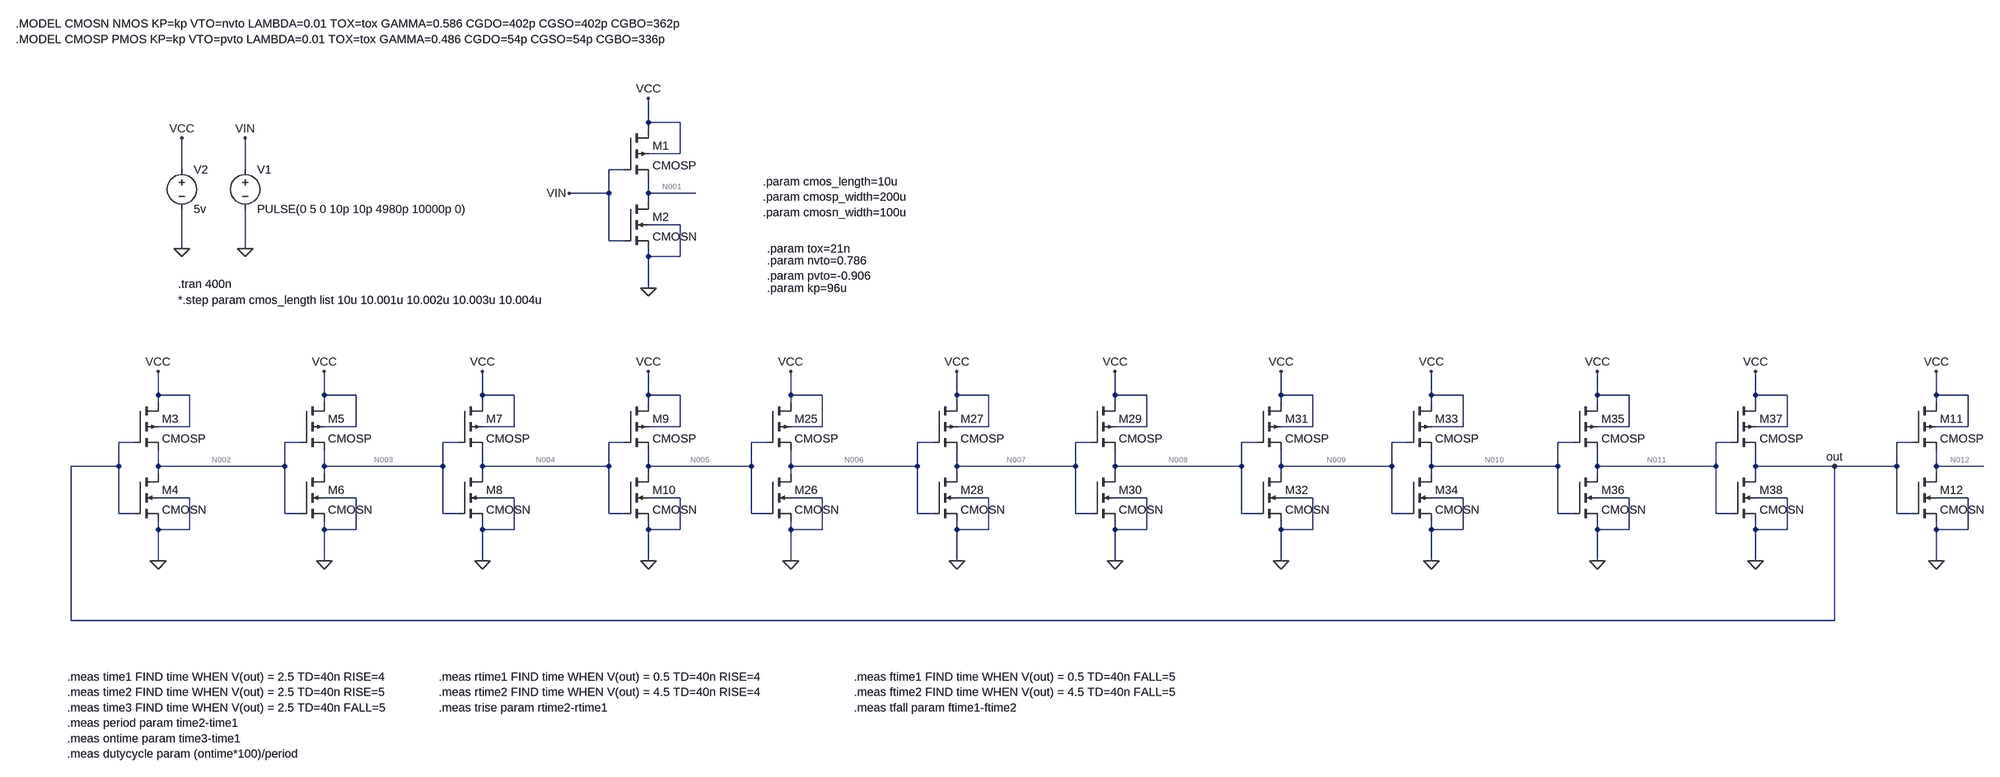
[diagram p0: schematic Ring Oscillator.asc]
Ring Oscillator.asc, the LTspice schematic file:
Version 4
SHEET 1 3220 2068
WIRE 416 112 416 64
WIRE 480 112 416 112
WIRE 416 128 416 112
WIRE 480 176 480 112
WIRE 480 176 416 176
WIRE -528 208 -528 144
WIRE -400 208 -400 144
WIRE 368 208 336 208
WIRE 336 256 336 208
WIRE 336 256 256 256
WIRE 416 256 416 224
WIRE 512 256 416 256
WIRE 416 272 416 256
WIRE 480 320 416 320
WIRE 336 352 336 256
WIRE 368 352 336 352
WIRE -528 368 -528 288
WIRE -400 368 -400 288
WIRE 416 384 416 368
WIRE 480 384 480 320
WIRE 480 384 416 384
WIRE 416 448 416 384
WIRE -576 720 -576 672
WIRE -512 720 -576 720
WIRE -240 720 -240 672
WIRE -176 720 -240 720
WIRE 80 720 80 672
WIRE 144 720 80 720
WIRE 416 720 416 672
WIRE 480 720 416 720
WIRE 704 720 704 672
WIRE 768 720 704 720
WIRE 1040 720 1040 672
WIRE 1104 720 1040 720
WIRE 1360 720 1360 672
WIRE 1424 720 1360 720
WIRE 1696 720 1696 672
WIRE 1760 720 1696 720
WIRE 2000 720 2000 672
WIRE 2064 720 2000 720
WIRE 2336 720 2336 672
WIRE 2400 720 2336 720
WIRE 2656 720 2656 672
WIRE 2720 720 2656 720
WIRE 3120 720 3120 672
WIRE 3184 720 3120 720
WIRE -576 736 -576 720
WIRE -240 736 -240 720
WIRE 80 736 80 720
WIRE 416 736 416 720
WIRE 704 736 704 720
WIRE 1040 736 1040 720
WIRE 1360 736 1360 720
WIRE 1696 736 1696 720
WIRE 2000 736 2000 720
WIRE 2336 736 2336 720
WIRE 2656 736 2656 720
WIRE 3120 736 3120 720
WIRE -512 784 -512 720
WIRE -512 784 -576 784
WIRE -176 784 -176 720
WIRE -176 784 -240 784
WIRE 144 784 144 720
WIRE 144 784 80 784
WIRE 480 784 480 720
WIRE 480 784 416 784
WIRE 768 784 768 720
WIRE 768 784 704 784
WIRE 1104 784 1104 720
WIRE 1104 784 1040 784
WIRE 1424 784 1424 720
WIRE 1424 784 1360 784
WIRE 1760 784 1760 720
WIRE 1760 784 1696 784
WIRE 2064 784 2064 720
WIRE 2064 784 2000 784
WIRE 2400 784 2400 720
WIRE 2400 784 2336 784
WIRE 2720 784 2720 720
WIRE 2720 784 2656 784
WIRE 3184 784 3184 720
WIRE 3184 784 3120 784
WIRE -624 816 -656 816
WIRE -288 816 -320 816
WIRE 32 816 0 816
WIRE 368 816 336 816
WIRE 656 816 624 816
WIRE 992 816 960 816
WIRE 1312 816 1280 816
WIRE 1648 816 1616 816
WIRE 1952 816 1920 816
WIRE 2288 816 2256 816
WIRE 2608 816 2576 816
WIRE 3072 816 3040 816
WIRE -656 864 -656 816
WIRE -656 864 -752 864
WIRE -576 864 -576 832
WIRE -320 864 -320 816
WIRE -320 864 -576 864
WIRE -240 864 -240 832
WIRE 0 864 0 816
WIRE 0 864 -240 864
WIRE 80 864 80 832
WIRE 336 864 336 816
WIRE 336 864 80 864
WIRE 416 864 416 832
WIRE 624 864 624 816
WIRE 624 864 416 864
WIRE 704 864 704 832
WIRE 960 864 960 816
WIRE 960 864 704 864
WIRE 1040 864 1040 832
WIRE 1280 864 1280 816
WIRE 1280 864 1040 864
WIRE 1360 864 1360 832
WIRE 1616 864 1616 816
WIRE 1616 864 1360 864
WIRE 1696 864 1696 832
WIRE 1920 864 1920 816
WIRE 1920 864 1696 864
WIRE 2000 864 2000 832
WIRE 2256 864 2256 816
WIRE 2256 864 2000 864
WIRE 2336 864 2336 832
WIRE 2576 864 2576 816
WIRE 2576 864 2336 864
WIRE 2656 864 2656 832
WIRE 2816 864 2656 864
WIRE 3040 864 3040 816
WIRE 3040 864 2816 864
WIRE 3120 864 3120 832
WIRE 3216 864 3120 864
WIRE -576 880 -576 864
WIRE -240 880 -240 864
WIRE 80 880 80 864
WIRE 416 880 416 864
WIRE 704 880 704 864
WIRE 1040 880 1040 864
WIRE 1360 880 1360 864
WIRE 1696 880 1696 864
WIRE 2000 880 2000 864
WIRE 2336 880 2336 864
WIRE 2656 880 2656 864
WIRE 3120 880 3120 864
WIRE -512 928 -576 928
WIRE -176 928 -240 928
WIRE 144 928 80 928
WIRE 480 928 416 928
WIRE 768 928 704 928
WIRE 1104 928 1040 928
WIRE 1424 928 1360 928
WIRE 1760 928 1696 928
WIRE 2064 928 2000 928
WIRE 2400 928 2336 928
WIRE 2720 928 2656 928
WIRE 3184 928 3120 928
WIRE -656 960 -656 864
WIRE -624 960 -656 960
WIRE -320 960 -320 864
WIRE -288 960 -320 960
WIRE 0 960 0 864
WIRE 32 960 0 960
WIRE 336 960 336 864
WIRE 368 960 336 960
WIRE 624 960 624 864
WIRE 656 960 624 960
WIRE 960 960 960 864
WIRE 992 960 960 960
WIRE 1280 960 1280 864
WIRE 1312 960 1280 960
WIRE 1616 960 1616 864
WIRE 1648 960 1616 960
WIRE 1920 960 1920 864
WIRE 1952 960 1920 960
WIRE 2256 960 2256 864
WIRE 2288 960 2256 960
WIRE 2576 960 2576 864
WIRE 2608 960 2576 960
WIRE 3040 960 3040 864
WIRE 3072 960 3040 960
WIRE -576 992 -576 976
WIRE -512 992 -512 928
WIRE -512 992 -576 992
WIRE -240 992 -240 976
WIRE -176 992 -176 928
WIRE -176 992 -240 992
WIRE 80 992 80 976
WIRE 144 992 144 928
WIRE 144 992 80 992
WIRE 416 992 416 976
WIRE 480 992 480 928
WIRE 480 992 416 992
WIRE 704 992 704 976
WIRE 768 992 768 928
WIRE 768 992 704 992
WIRE 1040 992 1040 976
WIRE 1104 992 1104 928
WIRE 1104 992 1040 992
WIRE 1360 992 1360 976
WIRE 1424 992 1424 928
WIRE 1424 992 1360 992
WIRE 1696 992 1696 976
WIRE 1760 992 1760 928
WIRE 1760 992 1696 992
WIRE 2000 992 2000 976
WIRE 2064 992 2064 928
WIRE 2064 992 2000 992
WIRE 2336 992 2336 976
WIRE 2400 992 2400 928
WIRE 2400 992 2336 992
WIRE 2656 992 2656 976
WIRE 2720 992 2720 928
WIRE 2720 992 2656 992
WIRE 3120 992 3120 976
WIRE 3184 992 3184 928
WIRE 3184 992 3120 992
WIRE -576 1056 -576 992
WIRE -240 1056 -240 992
WIRE 80 1056 80 992
WIRE 416 1056 416 992
WIRE 704 1056 704 992
WIRE 1040 1056 1040 992
WIRE 1360 1056 1360 992
WIRE 1696 1056 1696 992
WIRE 2000 1056 2000 992
WIRE 2336 1056 2336 992
WIRE 2656 1056 2656 992
WIRE 3120 1056 3120 992
WIRE -752 1200 -752 864
WIRE 2816 1200 2816 864
WIRE 2816 1200 -752 1200
FLAG -400 368 0
FLAG -400 144 VIN
FLAG 416 448 0
FLAG 416 64 VCC
FLAG -528 368 0
FLAG -528 144 VCC
FLAG 256 256 VIN
FLAG -576 1056 0
FLAG -576 672 VCC
FLAG -240 1056 0
FLAG -240 672 VCC
FLAG 80 1056 0
FLAG 80 672 VCC
FLAG 416 1056 0
FLAG 416 672 VCC
FLAG 704 1056 0
FLAG 704 672 VCC
FLAG 1040 1056 0
FLAG 1040 672 VCC
FLAG 1360 1056 0
FLAG 1360 672 VCC
FLAG 1696 1056 0
FLAG 1696 672 VCC
FLAG 2000 1056 0
FLAG 2000 672 VCC
FLAG 2336 1056 0
FLAG 2336 672 VCC
FLAG 2656 1056 0
FLAG 2656 672 VCC
FLAG 3120 1056 0
FLAG 3120 672 VCC
FLAG 2816 864 out
SYMBOL pmos4 368 128 R0
SYMATTR InstName M1
SYMATTR Value CMOSP
SYMATTR Value2 l=cmos_length w=cmosp_width
SYMBOL nmos4 368 272 R0
SYMATTR InstName M2
SYMATTR Value CMOSN
SYMATTR Value2 l=cmos_length w=cmosn_width
SYMBOL voltage -400 192 R0
WINDOW 123 0 0 Left 0
WINDOW 39 0 0 Left 0
SYMATTR InstName V1
SYMATTR Value PULSE(0 5 0 10p 10p 4980p 10000p 0)
SYMBOL voltage -528 192 R0
WINDOW 123 0 0 Left 0
WINDOW 39 0 0 Left 0
SYMATTR InstName V2
SYMATTR Value 5v
SYMBOL pmos4 -624 736 R0
SYMATTR InstName M3
SYMATTR Value CMOSP
SYMATTR Value2 l=cmos_length w=cmosp_width
SYMBOL nmos4 -624 880 R0
SYMATTR InstName M4
SYMATTR Value CMOSN
SYMATTR Value2 l=cmos_length w=cmosn_width
SYMBOL pmos4 -288 736 R0
SYMATTR InstName M5
SYMATTR Value CMOSP
SYMATTR Value2 l=cmos_length w=cmosp_width
SYMBOL nmos4 -288 880 R0
SYMATTR InstName M6
SYMATTR Value CMOSN
SYMATTR Value2 l=cmos_length w=cmosn_width
SYMBOL pmos4 32 736 R0
SYMATTR InstName M7
SYMATTR Value CMOSP
SYMATTR Value2 l=cmos_length w=cmosp_width
SYMBOL nmos4 32 880 R0
SYMATTR InstName M8
SYMATTR Value CMOSN
SYMATTR Value2 l=cmos_length w=cmosn_width
SYMBOL pmos4 368 736 R0
SYMATTR InstName M9
SYMATTR Value CMOSP
SYMATTR Value2 l=cmos_length w=cmosp_width
SYMBOL nmos4 368 880 R0
SYMATTR InstName M10
SYMATTR Value CMOSN
SYMATTR Value2 l=cmos_length w=cmosn_width
SYMBOL pmos4 656 736 R0
SYMATTR InstName M25
SYMATTR Value CMOSP
SYMATTR Value2 l=cmos_length w=cmosp_width
SYMBOL nmos4 656 880 R0
SYMATTR InstName M26
SYMATTR Value CMOSN
SYMATTR Value2 l=cmos_length w=cmosn_width
SYMBOL pmos4 992 736 R0
SYMATTR InstName M27
SYMATTR Value CMOSP
SYMATTR Value2 l=cmos_length w=cmosp_width
SYMBOL nmos4 992 880 R0
SYMATTR InstName M28
SYMATTR Value CMOSN
SYMATTR Value2 l=cmos_length w=cmosn_width
SYMBOL pmos4 1312 736 R0
SYMATTR InstName M29
SYMATTR Value CMOSP
SYMATTR Value2 l=cmos_length w=cmosp_width
SYMBOL nmos4 1312 880 R0
SYMATTR InstName M30
SYMATTR Value CMOSN
SYMATTR Value2 l=cmos_length w=cmosn_width
SYMBOL pmos4 1648 736 R0
SYMATTR InstName M31
SYMATTR Value CMOSP
SYMATTR Value2 l=cmos_length w=cmosp_width
SYMBOL nmos4 1648 880 R0
SYMATTR InstName M32
SYMATTR Value CMOSN
SYMATTR Value2 l=cmos_length w=cmosn_width
SYMBOL pmos4 1952 736 R0
SYMATTR InstName M33
SYMATTR Value CMOSP
SYMATTR Value2 l=cmos_length w=cmosp_width
SYMBOL nmos4 1952 880 R0
SYMATTR InstName M34
SYMATTR Value CMOSN
SYMATTR Value2 l=cmos_length w=cmosn_width
SYMBOL pmos4 2288 736 R0
SYMATTR InstName M35
SYMATTR Value CMOSP
SYMATTR Value2 l=cmos_length w=cmosp_width
SYMBOL nmos4 2288 880 R0
SYMATTR InstName M36
SYMATTR Value CMOSN
SYMATTR Value2 l=cmos_length w=cmosn_width
SYMBOL pmos4 2608 736 R0
SYMATTR InstName M37
SYMATTR Value CMOSP
SYMATTR Value2 l=cmos_length w=cmosp_width
SYMBOL nmos4 2608 880 R0
SYMATTR InstName M38
SYMATTR Value CMOSN
SYMATTR Value2 l=cmos_length w=cmosn_width
SYMBOL pmos4 3072 736 R0
SYMATTR InstName M11
SYMATTR Value CMOSP
SYMATTR Value2 l=cmos_length w=cmosp_width
SYMBOL nmos4 3072 880 R0
SYMATTR InstName M12
SYMATTR Value CMOSN
SYMATTR Value2 l=cmos_length w=cmosn_width
TEXT -864 -88 Left 2 !.MODEL CMOSN NMOS KP=kp VTO=nvto LAMBDA=0.01 TOX=tox GAMMA=0.586 CGDO=402p CGSO=402p CGBO=362p
TEXT -864 -56 Left 2 !.MODEL CMOSP PMOS KP=kp VTO=pvto LAMBDA=0.01 TOX=tox GAMMA=0.486 CGDO=54p CGSO=54p CGBO=336p
TEXT -536 440 Left 2 !.tran 400n
TEXT -536 472 Left 2 !*.step param cmos_length list 10u 10.001u 10.002u 10.003u 10.004u
TEXT 648 232 Left 2 !.param cmos_length=10u\n.param cmosp_width=200u\n.param cmosn_width=100u
TEXT -760 1344 Left 2 !.meas time1 FIND time WHEN V(out) = 2.5 TD=40n RISE=4\n.meas time2 FIND time WHEN V(out) = 2.5 TD=40n RISE=5\n.meas time3 FIND time WHEN V(out) = 2.5 TD=40n FALL=5\n.meas period param time2-time1\n.meas ontime param time3-time1\n.meas dutycycle param (ontime*100)/period
TEXT -8 1344 Left 2 !.meas rtime1 FIND time WHEN V(out) = 0.5 TD=40n RISE=4\n.meas rtime2 FIND time WHEN V(out) = 4.5 TD=40n RISE=4\n.meas trise param rtime2-rtime1
TEXT 832 1344 Left 2 !.meas ftime1 FIND time WHEN V(out) = 0.5 TD=40n FALL=5\n.meas ftime2 FIND time WHEN V(out) = 4.5 TD=40n FALL=5\n.meas tfall param ftime1-ftime2
TEXT 656 368 Left 2 !.param tox=21n
TEXT 656 392 Left 2 !.param nvto=0.786\n.param pvto=-0.906
TEXT 656 448 Left 2 !.param kp=96u

The netlist it stands for:
* Ring Oscillator.asc
M1 VCC VIN N001 VCC CMOSP l=cmos_length w=cmosp_width
M2 N001 VIN 0 0 CMOSN l=cmos_length w=cmosn_width
V1 VIN 0 PULSE(0 5 0 10p 10p 4980p 10000p 0)
V2 VCC 0 5v
M3 VCC out N002 VCC CMOSP l=cmos_length w=cmosp_width
M4 N002 out 0 0 CMOSN l=cmos_length w=cmosn_width
M5 VCC N002 N003 VCC CMOSP l=cmos_length w=cmosp_width
M6 N003 N002 0 0 CMOSN l=cmos_length w=cmosn_width
M7 VCC N003 N004 VCC CMOSP l=cmos_length w=cmosp_width
M8 N004 N003 0 0 CMOSN l=cmos_length w=cmosn_width
M9 VCC N004 N005 VCC CMOSP l=cmos_length w=cmosp_width
M10 N005 N004 0 0 CMOSN l=cmos_length w=cmosn_width
M25 VCC N005 N006 VCC CMOSP l=cmos_length w=cmosp_width
M26 N006 N005 0 0 CMOSN l=cmos_length w=cmosn_width
M27 VCC N006 N007 VCC CMOSP l=cmos_length w=cmosp_width
M28 N007 N006 0 0 CMOSN l=cmos_length w=cmosn_width
M29 VCC N007 N008 VCC CMOSP l=cmos_length w=cmosp_width
M30 N008 N007 0 0 CMOSN l=cmos_length w=cmosn_width
M31 VCC N008 N009 VCC CMOSP l=cmos_length w=cmosp_width
M32 N009 N008 0 0 CMOSN l=cmos_length w=cmosn_width
M33 VCC N009 N010 VCC CMOSP l=cmos_length w=cmosp_width
M34 N010 N009 0 0 CMOSN l=cmos_length w=cmosn_width
M35 VCC N010 N011 VCC CMOSP l=cmos_length w=cmosp_width
M36 N011 N010 0 0 CMOSN l=cmos_length w=cmosn_width
M37 VCC N011 out VCC CMOSP l=cmos_length w=cmosp_width
M38 out N011 0 0 CMOSN l=cmos_length w=cmosn_width
M11 VCC out N012 VCC CMOSP l=cmos_length w=cmosp_width
M12 N012 out 0 0 CMOSN l=cmos_length w=cmosn_width
.model NMOS NMOS
.model PMOS PMOS
.lib standard.mos
.MODEL CMOSN NMOS KP=kp VTO=nvto LAMBDA=0.01 TOX=tox GAMMA=0.586 CGDO=402p CGSO=402p CGBO=362p
.MODEL CMOSP PMOS KP=kp VTO=pvto LAMBDA=0.01 TOX=tox GAMMA=0.486 CGDO=54p CGSO=54p CGBO=336p
.tran 400n
*.step param cmos_length list 10u 10.001u 10.002u 10.003u 10.004u
.param cmos_length=10u
.param cmosp_width=200u
.param cmosn_width=100u
.meas time1 FIND time WHEN V(out) = 2.5 TD=40n RISE=4
.meas time2 FIND time WHEN V(out) = 2.5 TD=40n RISE=5
.meas time3 FIND time WHEN V(out) = 2.5 TD=40n FALL=5
.meas period param time2-time1
.meas ontime param time3-time1
.meas dutycycle param (ontime*100)/period
.meas rtime1 FIND time WHEN V(out) = 0.5 TD=40n RISE=4
.meas rtime2 FIND time WHEN V(out) = 4.5 TD=40n RISE=4
.meas trise param rtime2-rtime1
.meas ftime1 FIND time WHEN V(out) = 0.5 TD=40n FALL=5
.meas ftime2 FIND time WHEN V(out) = 4.5 TD=40n FALL=5
.meas tfall param ftime1-ftime2
.param tox=21n
.param nvto=0.786
.param pvto=-0.906
.param kp=96u
.backanno
.end

* Results of the author's LTspice run, read from the files saved beside the schematic
* Operating Point, zero values left out:
*   V(vcc) = 5 V
*   V(n001) = 5 V
*   V(out) = 2.722 V
*   V(n002) = 2.722 V
*   V(n003) = 2.722 V
*   V(n004) = 2.722 V
*   V(n005) = 2.722 V
*   V(n006) = 2.722 V
*   V(n007) = 2.722 V
*   V(n008) = 2.722 V
*   V(n009) = 2.722 V
*   V(n010) = 2.722 V
*   V(n011) = 2.722 V
*   V(n012) = 2.722 V
*   Id(M1) = 10.01 pA
*   Is(M1) = -10.01 pA
*   Id(M3) = 1.848 mA
*   Ib(M3) = 2.288 pA
*   Is(M3) = -1.848 mA
*   Id(M5) = 1.848 mA
*   Ib(M5) = 2.288 pA
*   Is(M5) = -1.848 mA
*   Id(M7) = 1.848 mA
*   Ib(M7) = 2.288 pA
*   Is(M7) = -1.848 mA
*   Id(M9) = 1.848 mA
*   Ib(M9) = 2.288 pA
*   Is(M9) = -1.848 mA
*   Id(M25) = 1.848 mA
*   Ib(M25) = 2.288 pA
*   Is(M25) = -1.848 mA
*   Id(M27) = 1.848 mA
*   Ib(M27) = 2.288 pA
*   Is(M27) = -1.848 mA
*   Id(M29) = 1.848 mA
*   Ib(M29) = 2.288 pA
*   Is(M29) = -1.848 mA
*   Id(M31) = 1.848 mA
*   Ib(M31) = 2.288 pA
*   Is(M31) = -1.848 mA
*   Id(M33) = 1.848 mA
*   Ib(M33) = 2.288 pA
*   Is(M33) = -1.848 mA
*   Id(M35) = 1.848 mA
*   Ib(M35) = 2.288 pA
*   Is(M35) = -1.848 mA
*   Id(M37) = 1.848 mA
*   Ib(M37) = 2.288 pA
*   Is(M37) = -1.848 mA
*   Id(M11) = 1.848 mA
*   Ib(M11) = 2.288 pA
*   Is(M11) = -1.848 mA
*   Id(M2) = 10.01 pA
*   Ib(M2) = -5.01 pA
*   Is(M2) = -5 pA
*   Id(M4) = 1.848 mA
*   Ib(M4) = -2.732 pA
*   Is(M4) = -1.848 mA
*   Id(M6) = 1.848 mA
*   Ib(M6) = -2.732 pA
*   Is(M6) = -1.848 mA
*   Id(M8) = 1.848 mA
*   Ib(M8) = -2.732 pA
*   Is(M8) = -1.848 mA
*   Id(M10) = 1.848 mA
*   Ib(M10) = -2.732 pA
*   Is(M10) = -1.848 mA
*   Id(M26) = 1.848 mA
*   Ib(M26) = -2.732 pA
*   Is(M26) = -1.848 mA
*   Id(M28) = 1.848 mA
*   Ib(M28) = -2.732 pA
*   Is(M28) = -1.848 mA
*   Id(M30) = 1.848 mA
*   Ib(M30) = -2.732 pA
*   Is(M30) = -1.848 mA
*   Id(M32) = 1.848 mA
*   Ib(M32) = -2.732 pA
*   Is(M32) = -1.848 mA
*   Id(M34) = 1.848 mA
*   Ib(M34) = -2.732 pA
*   Is(M34) = -1.848 mA
*   Id(M36) = 1.848 mA
*   Ib(M36) = -2.732 pA
*   Is(M36) = -1.848 mA
*   Id(M38) = 1.848 mA
*   Ib(M38) = -2.732 pA
*   Is(M38) = -1.848 mA
*   Id(M12) = 1.848 mA
*   Ib(M12) = -2.732 pA
*   Is(M12) = -1.848 mA
*   I(V2) = -22.18 mA
* From the log:
*   time1: time=2.83337e-07 at 2.83337e-07
*   time2: time=3.48109e-07 at 3.48109e-07
*   time3: time=3.16403e-07 at 3.16403e-07
*   period: time2-time1=6.4772e-08
*   ontime: time3-time1=3.30659e-08
*   dutycycle: (ontime*100)/period=51.0497
*   rtime1: time=2.81412e-07 at 2.81412e-07
*   rtime2: time=2.87183e-07 at 2.87183e-07
*   trise: rtime2-rtime1=5.77018e-09
*   ftime1: time=3.23042e-07 at 3.23042e-07
*   ftime2: time=3.13944e-07 at 3.13944e-07
*   tfall: ftime1-ftime2=9.0982e-09